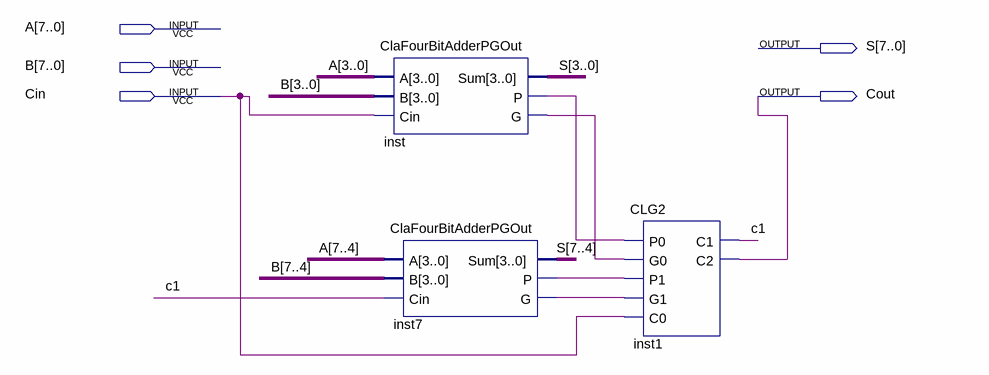
[diagram p0: schematic sheet]
// Quartus schematic Adder8Bit.bdf as structural Verilog: 3 symbols, 5 pins
module Adder8Bit (
  input  [7:0] A,
  input  [7:0] B,
  input  Cin,
  output [7:0] S,
  output Cout
);

  wire c1, inst7_g, inst7_p, inst_g, inst_p;

  ClaFourBitAdderPGOut inst (.A(A[3:0]), .B(B[3:0]), .Cin(Cin), .Sum(S[3:0]), .P(inst_p), .G(inst_g));
  ClaFourBitAdderPGOut inst7 (.A(A[7:4]), .B(B[7:4]), .Cin(c1), .Sum(S[7:4]), .P(inst7_p), .G(inst7_g));
  CLG2 inst1 (.P0(inst_p), .G0(inst_g), .P1(inst7_p), .G1(inst7_g), .C0(Cin), .C1(c1), .C2(Cout));
endmodule
